# Altium schematic sheet m2_emmc.SchDoc
size D; Organization: Altium Limited; Address1: 3 Minna Close; Address2: Belrose; Address3: NSW 2085; Address4: Australia; SheetNumber: 1; SheetTotal: 3; PAGE_TITLE: -
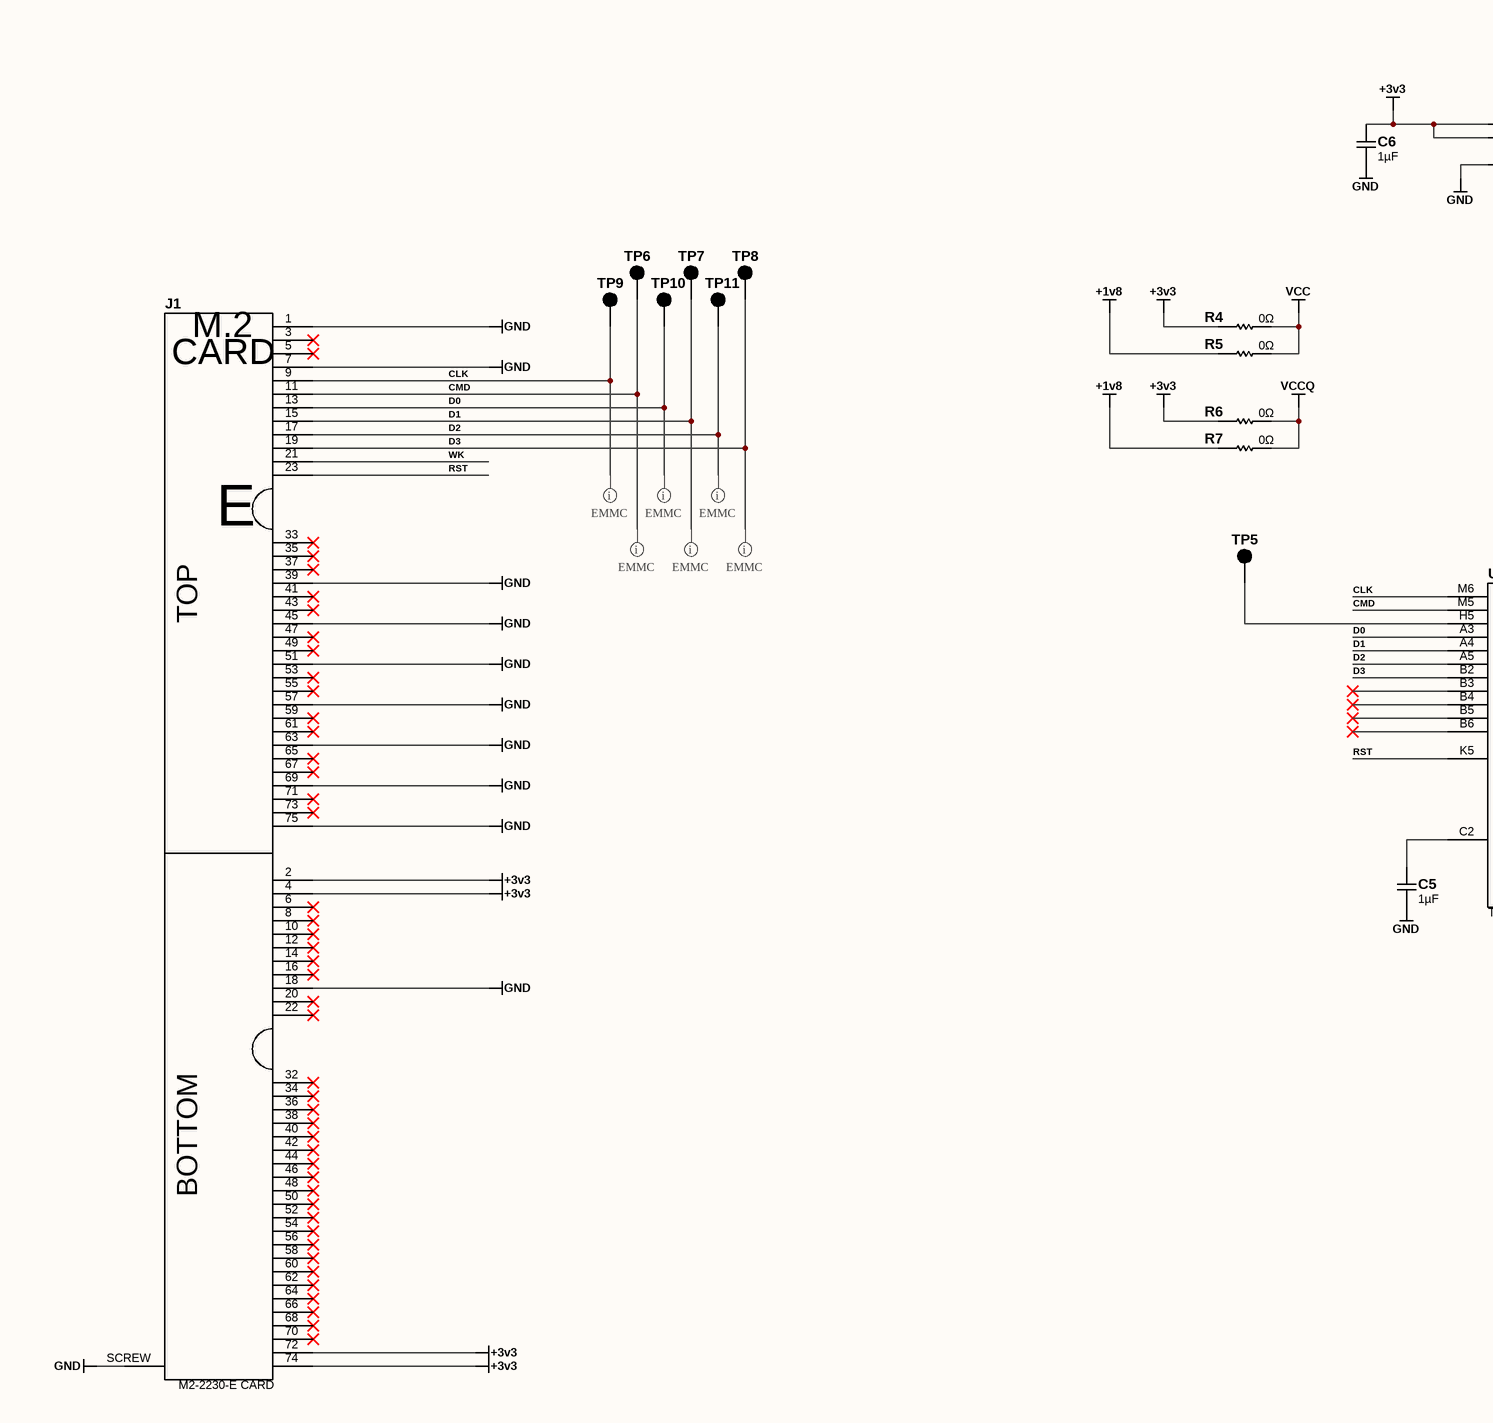
[diagram p0: m2_emmc.SchDoc, top left]
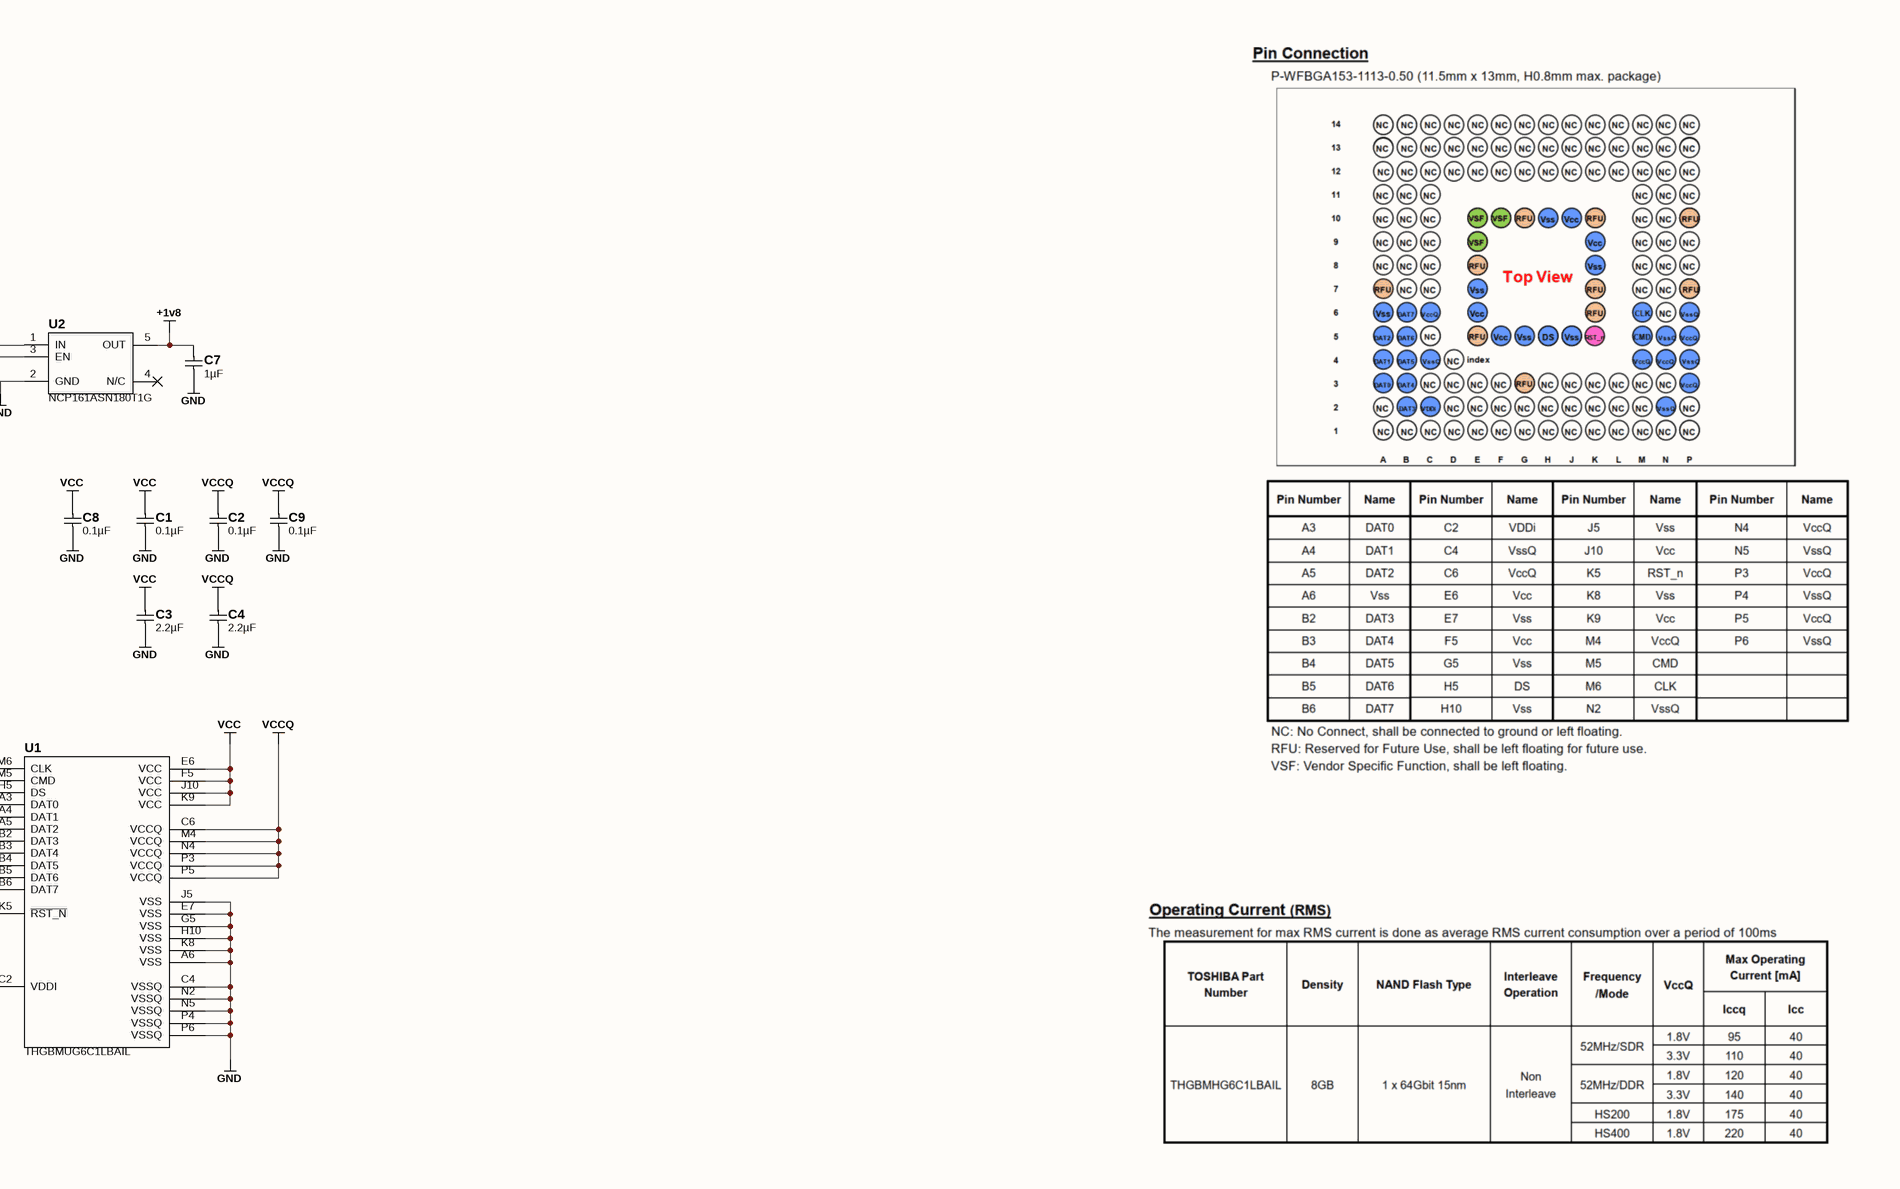
[diagram p1: m2_emmc.SchDoc, top right]
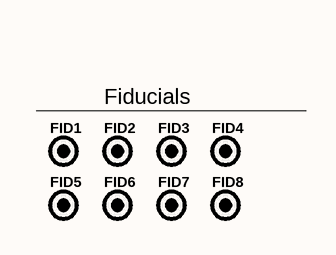
[diagram p2: m2_emmc.SchDoc, bottom left]
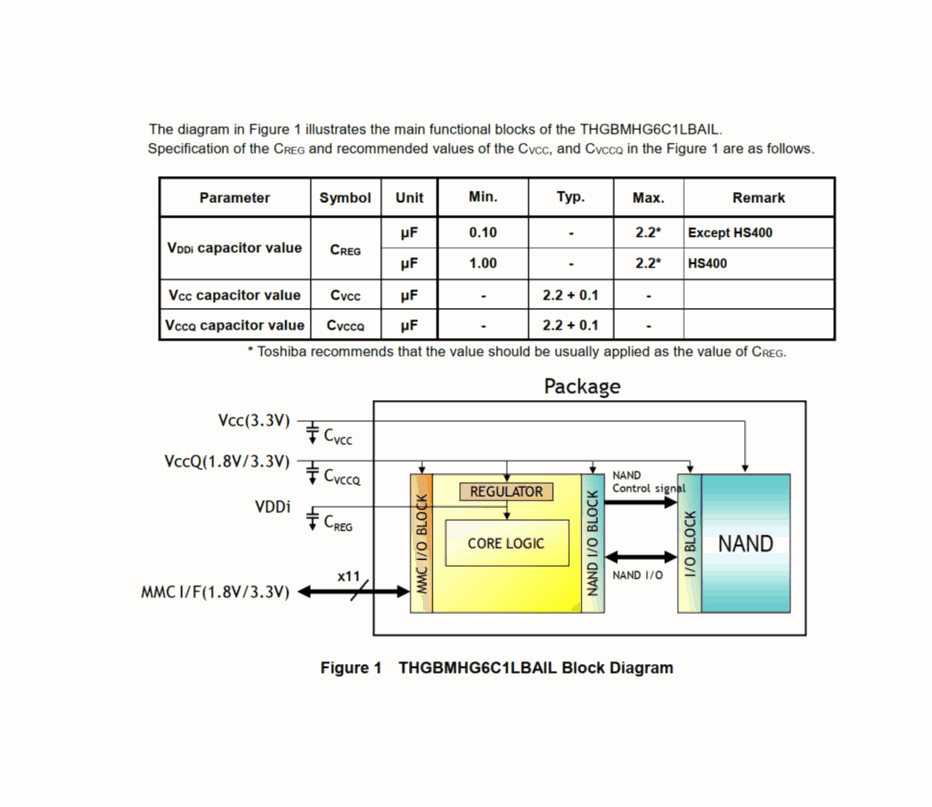
[diagram p3: m2_emmc.SchDoc, bottom right]

## Parts
C1  0.1µF  [C0603_0.90MM_HD]
C2  0.1µF  [C0603_0.90MM_HD]
C3  2.2µF  [C0603_0.90MM_HD]
C4  2.2µF  [C0603_0.90MM_HD]
C5  1µF  [C0603_0.90MM_HD]
C6  1µF  [C0603_0.90MM_HD]
C7  1µF  [C0603_0.90MM_HD]
C8  0.1µF  [C0603_0.90MM_HD]
C9  0.1µF  [C0603_0.90MM_HD]
FID1  fiducial-1mm-2mm  [fiducial-1mm-2mm]  (value not drawn)  (no BOM)
FID2  fiducial-1mm-2mm  [fiducial-1mm-2mm]  (value not drawn)  (no BOM)
FID3  fiducial-1mm-2mm  [fiducial-1mm-2mm]  (value not drawn)  (no BOM)
FID4  fiducial-1mm-2mm  [fiducial-1mm-2mm]  (value not drawn)  (no BOM)
FID5  fiducial-1mm-2mm  [fiducial-1mm-2mm]  (value not drawn)  (no BOM)
FID6  fiducial-1mm-2mm  [fiducial-1mm-2mm]  (value not drawn)  (no BOM)
FID7  fiducial-1mm-2mm  [fiducial-1mm-2mm]  (value not drawn)  (no BOM)
FID8  fiducial-1mm-2mm  [fiducial-1mm-2mm]  (value not drawn)  (no BOM)
J1  M2-2230-E CARD  [M2-2230-E]  (no BOM)
R4  0Ω  [R0603_0.55MM_HD]
R5  0Ω  [R0603_0.55MM_HD]
R6  0Ω  [R0603_0.55MM_HD]
R7  0Ω  [R0603_0.55MM_HD]
TP5  SMT Testpoint 20mil  [SMT_TP-25]  (value not drawn)  (no BOM)
TP6  SMT Testpoint 20mil  [SMT_TP-25]  (value not drawn)  (no BOM)
TP7  SMT Testpoint 20mil  [SMT_TP-25]  (value not drawn)  (no BOM)
TP8  SMT Testpoint 20mil  [SMT_TP-25]  (value not drawn)  (no BOM)
TP9  SMT Testpoint 20mil  [SMT_TP-25]  (value not drawn)  (no BOM)
TP10  SMT Testpoint 20mil  [SMT_TP-25]  (value not drawn)  (no BOM)
TP11  SMT Testpoint 20mil  [SMT_TP-25]  (value not drawn)  (no BOM)
U1  THGBMUG6C1LBAIL  [BGA153C50P14X14_1150X1300X80]
U2  NCP161ASN180T1G  [SOT23-5]

## Nets
+1v8: C7.2 R5.1 R7.1 U2.5(OUT)
+3v3: C6.2 J1.2 J1.4 J1.72 J1.74 R4.1 R6.1 U2.1(IN) U2.3(EN)
GND: C1.1 C2.1 C3.1 C4.1 C5.1 C6.1 C7.1 C8.1 C9.1 J1.1 J1.7 J1.18 J1.39 J1.45 J1.51 J1.57 J1.63 J1.69 J1.75 J1.SCREW U1.A6(VSS) U1.C4(VSSQ) U1.E7(VSS) U1.G5(VSS) U1.H10(VSS) U1.J5(VSS) U1.K8(VSS) U1.N2(VSSQ) U1.N5(VSSQ) U1.P4(VSSQ) U1.P6(VSSQ) U2.2(GND)
VCC: C1.2 C3.2 C8.2 R4.2 R5.2 U1.E6(VCC) U1.F5(VCC) U1.J10(VCC) U1.K9(VCC)
VCCQ: C2.2 C4.2 C9.2 R6.2 R7.2 U1.C6(VCCQ) U1.M4(VCCQ) U1.N4(VCCQ) U1.P3(VCCQ) U1.P5(VCCQ)
CLK: J1.9 TP9.1 U1.M6(CLK)
CMD: J1.11 TP6.1 U1.M5(CMD)
D0: J1.13 TP10.1 U1.A3(DAT0)
D1: J1.15 TP7.1 U1.A4(DAT1)
D2: J1.17 TP11.1 U1.A5(DAT2)
D3: J1.19 TP8.1 U1.B2(DAT3)
RST: J1.23 U1.K5(~{RST_N})
WK: J1.21
NetC5_2: C5.2 U1.C2(VDDI)
NetTP5_1: TP5.1 U1.H5(DS)

Not connected (* = marked no-connect by the designer): J1 3* 5* 6* 8* 10* 12* 14* 16* 20* 22* 32* 33* 34* 35* 36* 37* 38* 40* 41* 42* 43* 44* 46* 47* 48* 49* 50* 52* 53* 54* 55* 56* 58* 59* 60* 61* 62* 64* 65* 66* 67* 68* 70* 71* 73*; U1 B3(DAT4)* B4(DAT5)* B5(DAT6)* B6(DAT7)*; U2 4(N/C)*

## Layout directives
net class EMMC: CLK, CMD, D0, D1, D2, D3

## Notes on the sheet
- Fiducials
- Part Number
- Description
- PCB Mixdown
- Date
- CCA Mixdown
- Engineer
- Page
- of
- (in symbol M2-2230-E CARD) M.2; CARD; E; TOP; BOTTOM

## Library data of the parts
C1 C2 C8 C9 = GCJ188R71C104KA01D: CAP CER 0.1UF 16V X7R 0603; Internal Part Number: nan; Manufacturer: Murata Electronics; Tolerance: ±10%; Substitution Notes: 0.1µF , 16V , ±10% , X7R , -55°C ~ 125°C , AEC-Q200 , 0603; kicad-symbol: Capacitor:C_2P_NP; kicad-footprint: C0603_0.90MM_MD:C0603_0.90MM_MD; Value: 0.1µF; Temperature Coefficient: X7R; Manufacturer Part Number: GCJ188R71C104KA01D; JLCPCB Part #: nan; Flags: nan; Category: Capacitors; Voltage - Rated: 16V; Operating Temperature: -55°C ~ 125°C; Ratings: AEC-Q200; Package: 603; Thickness (Max): 0.90MM
C3 C4 = GCM188R70J225KE22D: CAP CER 2.2UF 6.3V X7R 0603; Internal Part Number: nan; Manufacturer: Murata Electronics; Tolerance: ±10%; Substitution Notes: 2.2µF , 6.3V , ±10% , X7R , -55°C ~ 125°C , AEC-Q200 , 0603; kicad-symbol: Capacitor:C_2P_NP; kicad-footprint: C0603_0.90MM_MD:C0603_0.90MM_MD; Value: 2.2µF; Temperature Coefficient: X7R; Manufacturer Part Number: GCM188R70J225KE22D; JLCPCB Part #: nan; Flags: nan; Category: Capacitors; Voltage - Rated: 6.3V; Operating Temperature: -55°C ~ 125°C; Ratings: AEC-Q200; Package: 603; Thickness (Max): 0.90MM
C5-C7 = GCM188R71C105KA64J: CAP CER 1UF 16V X7R 0603; Internal Part Number: nan; Manufacturer: Murata Electronics; Tolerance: ±10%; Substitution Notes: 1µF , 16V , ±10% , X7R , -55°C ~ 125°C , AEC-Q200 , 0603; kicad-symbol: Capacitor:C_2P_NP; kicad-footprint: C0603_0.90MM_MD:C0603_0.90MM_MD; Value: 1µF; Temperature Coefficient: X7R; Manufacturer Part Number: GCM188R71C105KA64J; JLCPCB Part #: C2169902; Flags: nan; Category: Capacitors; Voltage - Rated: 16V; Operating Temperature: -55°C ~ 125°C; Ratings: AEC-Q200; Package: 603; Thickness (Max): 0.90MM
FID1-FID8 = fiducial-1mm-2mm: Manufacturer: Wavenumber; id: 4144; is_external: 0; Flags: no-bom; Value: fiducial-1mm-2mm; Manufacturer Part Number: fiducial-1mm-2mm
J1 = M2-2230-E CARD: M.2 2230 E Key Card Template; Manufacturer: Wavenumber; kicad-symbol: M2_CARD__E:M2_CARD__E; kicad-footprint: M2-2230-E:M2-2230-E; flags: NO_BOM; cad-reference: M2-2230-E CARD; Manufacturer Part Number: M2-2230-E CARD; Value: M2-2230-E CARD
R4-R7 = ERJ-3GEY0R00V: RES 0.0 OHM 1/10W JUMP 0603 SMD; Internal Part Number: nan; Manufacturer: Panasonic Electronic Components; Package Power: 0603  (0.1W); Resistance (Ohms): 0; Power (Watts): 0.1W- 1/10W; Tolerance: Jumper; Limiting Element Voltage: 75; Maximum Overload Voltage: 150; Maximum Working Voltage: 0.0V; Substitution Notes: 0 , Jumper , 0603 , AEC-Q200; kicad-symbol: Resistor:R_2P; kicad-footprint: R0603_0.55MM_HD:R0603_0.55MM_HD; Value: 0Ω; Manufacturer Part Number: ERJ-3GEY0R00V; JLCPCB Part #: C122704; Flags: nan; Manufacturer 1: Panasonic Electronic Components; Manufacturer Part Number 1: ERJ-3GEY0R00V; Supplier 1: Digi-Key; Supplier Part Number 1: P0.0GCT-ND; Category: Resistors; Composition: Thick Film; Features: -; Temperature Coefficient: -; Package: 0603 (1608 Metric); Supplier Package: 603; Height: 0.55MM; Number of Terminations: 2; Sort Value: 0; Sort Value Package: 603_0; Ratings: AEC-Q200
TP5-TP11 = SMT_TP-25: Manufacturer: Wavenumber; id: 4137; is_external: 0; Flags: no-bom; Manufacturer Part Number: SMT_TP-25; Value: SMT Testpoint 20mil
U1 = THGBMUG6C1LBAIL: eMMC 8GB v5.1 eMMC; Manufacturer: Kioxia America; Value: THGBMUG6C1LBAIL; Category: Integrated Circuits (ICs); Manufacturer Part Number: THGBMUG6C1LBAIL; Package / Case: 153WFBGA; Created By: JSA; JLCPCB Part #: C7509349
U2 = NCP161ASN180T1G: IC REG LINEAR 1.8V 450MA SOT23-5; Manufacturer: onsemi; Manufacturer Part Number: NCP161ASN180T1G; JLCPCB Part #: C22435172; Value: NCP161ASN180T1G